# Altium project OwlRoundDelay.PrjPcb
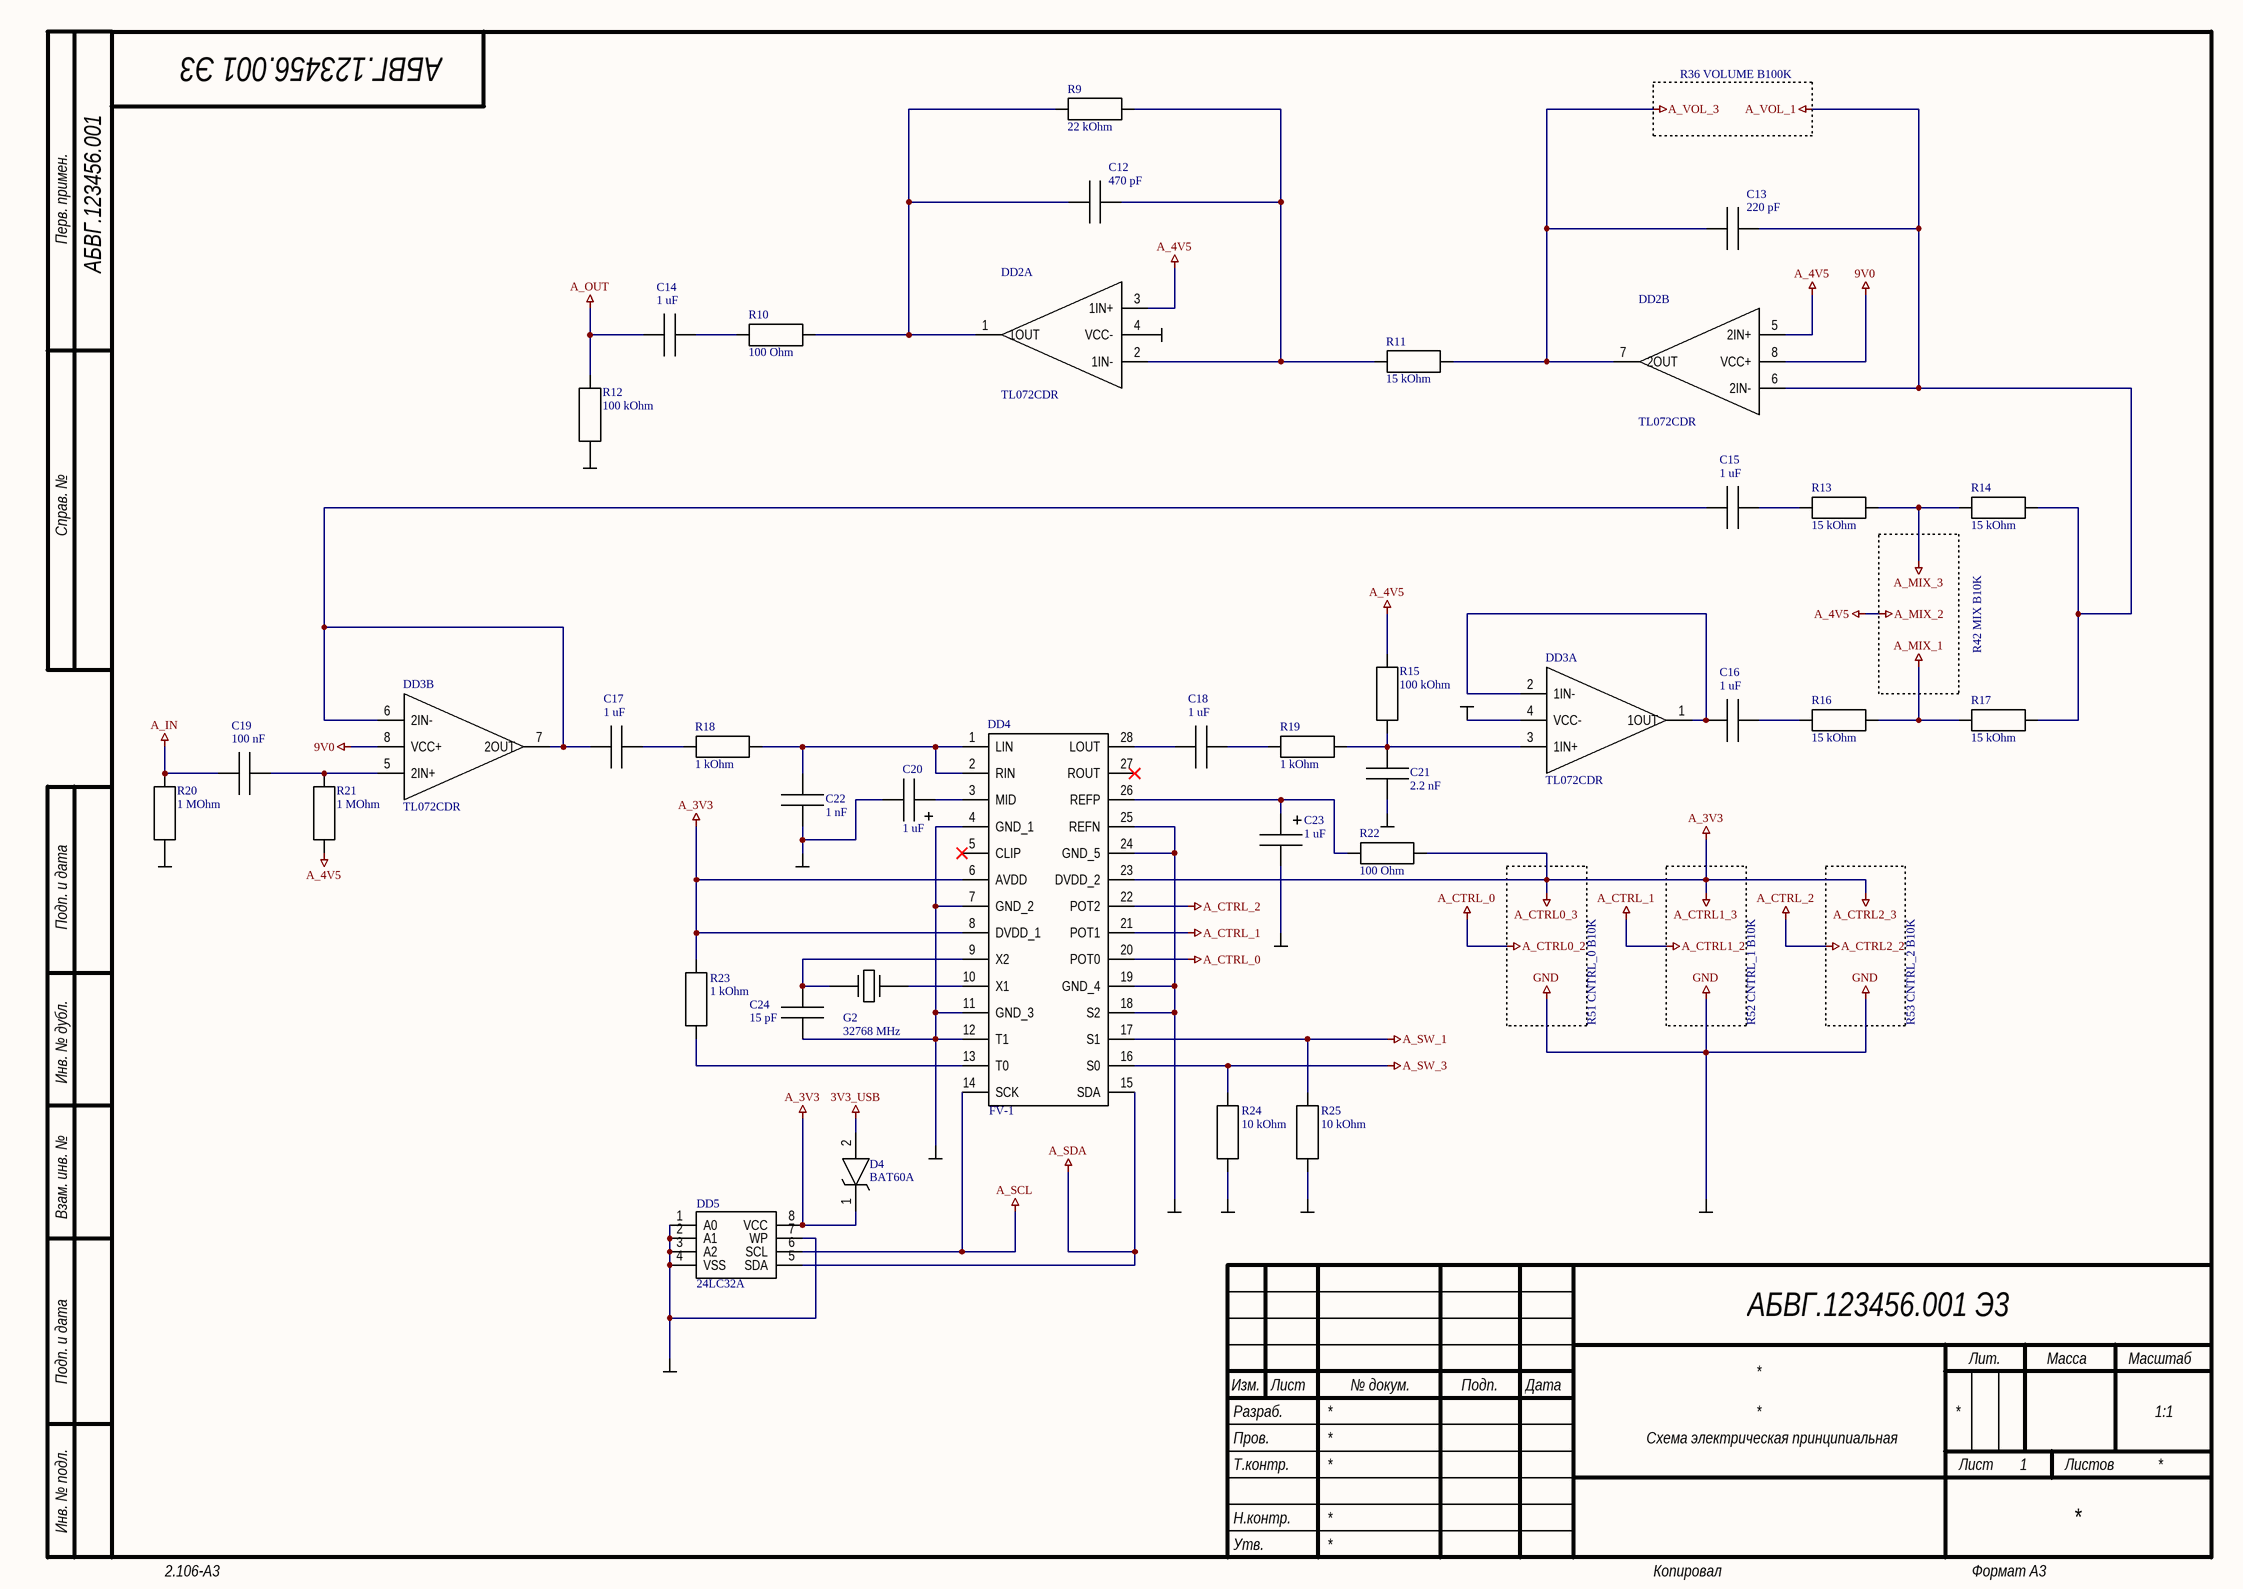
[diagram p0: ORD_FV1_1.SchDoc]
5 sheets, 107 parts. Net scope: global (net labels, ports and power ports of the same name join across sheets).
Board file: ORD_PCB.PcbDoc
Sheets:
  ORD_FV1_1.SchDoc
  ORD_FV1_2.SchDoc
  ORD_POWER.SchDoc
  ORD_CONNECTORS.SchDoc
  ORD_CH341A.SchDoc

## Sheet ORD_FV1_1.SchDoc
size 420 x 297 mm; Address1: Address1; Address2: Address2; Address3: Address3; Address4: Address4; DocumentNumber: АБВГ.123456.001 Э3; SheetNumber: 1; Scale: 1:1; DocumentType: Схема электрическая принципиальная; FirstReferrence: АБВГ.123456.001

### Parts
C12  470 pF  [C0805[2012]]
C13  220 pF  [C0805[2012]]
C14  1 uF  [C0805[2012]]
C15  1 uF  [C0805[2012]]
C16  1 uF  [C0805[2012]]
C17  1 uF  [C0805[2012]]
C18  1 uF  [C0805[2012]]
C19  100 nF  [C0805[2012]]
C20  1 uF  [C3216_CASE-A]
C21  2.2 nF  [C0805[2012]]
C22  1 nF  [C0805[2012]]
C23  1 uF  [C3216_CASE-A]
C24  15 pF  [C0805[2012]]
D4  BAT60A  [SOD323]
DD2  TL072CDR  [SO8]  (parts A,B of 2)
DD3  TL072CDR  [SO8]  (parts A,B of 2)
DD4  FV-1  [SOIC28]
DD5  24LC32A  [DIP8_WITH_SOCKET]
G2  32768 MHz  [HC-49]
R9  22 kOhm  [R0805[2012]]
R10  100 Ohm  [R0805[2012]]
R11  15 kOhm  [R0805[2012]]
R12  100 kOhm  [R0805[2012]]
R13  15 kOhm  [R0805[2012]]
R14  15 kOhm  [R0805[2012]]
R15  100 kOhm  [R0805[2012]]
R16  15 kOhm  [R0805[2012]]
R17  15 kOhm  [R0805[2012]]
R18  1 kOhm  [R0805[2012]]
R19  1 kOhm  [R0805[2012]]
R20  1 MOhm  [R0805[2012]]
R21  1 MOhm  [R0805[2012]]
R22  100 Ohm  [R0805[2012]]
R23  1 kOhm  [R0805[2012]]
R24  10 kOhm  [R0805[2012]]
R25  10 kOhm  [R0805[2012]]

### Nets
3V3_USB: D4.2(A)
9V0: DD2.8(VCC+) DD3.8(VCC+)
A_3V3: D4.1(K) DD4.6(AVDD) DD4.8(DVDD_1) DD4.23(DVDD_2) DD5.8(VCC) R22.1 R23.2  [also labelled A_CTRL0_3, A_CTRL1_3, A_CTRL2_3]
A_4V5: DD2.3(1IN+) DD2.5(2IN+) R15.1 R21.1  [also labelled A_MIX_2]
A_CTRL0_2: DD4.20(POT0)  [also labelled A_CTRL_0]
A_CTRL1_2: DD4.21(POT1)  [also labelled A_CTRL_1]
A_CTRL2_2: DD4.22(POT2)  [also labelled A_CTRL_2]
A_IN: C19.1 R20.2
A_MIX_1: R16.1 R17.2
A_MIX_3: R13.1 R14.2
A_OUT: C14.1 R12.2
A_SCL: DD4.14(SCK) DD5.6(SCL)
A_SDA: DD4.15(SDA) DD5.5(SDA)
A_SW_1: DD4.17(S1) R25.2
A_SW_3: DD4.16(S0) R24.2
A_VOL_1: C13.2 DD2.6(2IN-) R14.1 R17.1
A_VOL_3: C13.1 DD2.7(2OUT) R11.1
GND: C20.2 C21.1 C22.1 C23.2 C24.2 DD2.4(VCC-) DD3.4(VCC-) DD4.4(GND_1) DD4.7(GND_2) DD4.11(GND_3) DD4.12(T1) DD4.18(S2) DD4.19(GND_4) DD4.24(GND_5) DD4.25(REFN) DD5.1(A0) DD5.2(A1) DD5.3(A2) DD5.4(VSS) DD5.7(WP) R12.1 R20.1 R24.1 R25.1
NetC12_1: C12.1 DD2.1(1OUT) R9.2 R10.1
NetC12_2: C12.2 DD2.2(1IN-) R9.1 R11.2
NetC14_2: C14.2 R10.2
NetC15_1: C15.1 C17.1 DD3.6(2IN-) DD3.7(2OUT)
NetC15_2: C15.2 R13.2
NetC16_1: C16.1 DD3.1(1OUT) DD3.2(1IN-)
NetC16_2: C16.2 R16.2
NetC17_2: C17.2 R18.2
NetC18_1: C18.1 DD4.28(LOUT)
NetC18_2: C18.2 R19.2
NetC19_2: C19.2 DD3.5(2IN+) R21.2
NetC20_1: C20.1 DD4.3(MID)
NetC21_2: C21.2 DD3.3(1IN+) R15.2 R19.1
NetC22_2: C22.2 DD4.1(LIN) DD4.2(RIN) R18.1
NetC23_1: C23.1 DD4.26(REFP) R22.2
NetC24_1: C24.1 DD4.9(X2) G2.1
NetDD4_10: DD4.10(X1) G2.2
NetDD4_13: DD4.13(T0) R23.1

Not connected (* = marked no-connect by the designer): DD4 5(CLIP)* 27(ROUT)*

### Notes on the sheet
- R36 VOLUME B100K
- R42 MIX B10K
- R51 CNTRL_0 B10K
- R52 CNTRL_1 B10K
- R53 CNTRL_2 B10K
- Перв. примен.
- Справ. №
- Подп. и дата
- Инв. № дубл.
- Взам. инв. №
- Разраб.
- Изм.
- Лист
- № докум.
- Подп.
- Дата
- Лит.
- Масса
- Масштаб
- Пров.
- Т.контр.
- Листов
- Инв. № подл.
- Утв.
- Н.контр.
- 2.106-A3
- Копировал
- Формат А3

### Library data of the parts
C12-C19 C21 C22 C24 = Capacitor: Manufacture: *; ManufacturerPartNumber: *; Power/Voltage: *; Quantity: *; Rem: *; TKE: *; Tolerance: *; Корпус: *; Примечание: *
  C12: Value: 470 pF
  C13: Value: 220 pF
  C14-C18: Value: 1 uF
  C19: Value: 100 nF
  C21: Value: 2.2 nF
  C22: Value: 1 nF
  C24: Value: 15 pF
C20 C23 = Capacitor_Pol: Manufacture: *; ManufacturerPartNumber: *; Power/Voltage: *; Quantity: *; Rem: *; TKE: *; Tolerance: *; Value: 1 uF; Корпус: *; Примечание: *
D4 = BAT60A: Diode Schottky 10V 3A Automotive 2-Pin SOD-323 T/R; Manufacturer_Part_Number: BAT60A; Arrow Part Number: BAT60A
DD2 DD3 = TL072CDR: TL072CDR, Dual Operational Amplifier 4 MHz -18 to 18V, 8-Pin SO; Manufacturer_Name: STMicroelectronics; Manufacturer_Part_Number: LM358DT; Allied_Number: 70013708; Geometry.Height: 1.75mm; Mouser Part Number: 511-LM358DT; Mouser Price/Stock: https://www.mouser.com/Search/Refine.aspx?Keyword=511-LM358DT; RS Part Number: 7140827P; RS Price/Stock: http://uk.rs-online.com/web/p/products/7140827P; Allied Price/Stock: http://www.alliedelec.com/stmicroelectronics-lm358dt/70013708/; Datasheet Link: http://www.st.com/st-web-ui/static/active/en/resource/technical/document/datasheet/CD00000464.pdf
DD4 = FV-1: FV-1 Reverb IC, Integrated Stereo ADC & DAC, Integrated Circuit, SOIC-28 300 MIL; Manufacturer_Name: Spin Semiconductor; Geometry.Height: 2.51mm; Manufacturer_Part_Number: FV-1 Reverb IC; Mouser Part Number: *; Mouser Price/Stock: *; RS Part Number: *; RS Price/Stock: *; Datasheet Link: http://www.spinsemi.com/Products/datasheets/spn1001/FV-1.pdf
DD5 = 24LC32A: 32K I2C Serial EEPROM with Quarter-Array Write-Protect; Manufacturer_Name: Microchip; Manufacturer_Part_Number: 24LC32AF-I/P; Allied_Number: 70570177; Mouser Part Number: 579-24LC32AF-I/P; Mouser Price/Stock: https://www.mouser.com/Search/Refine.aspx?Keyword=579-24LC32AF-I%2FP; RS Part Number: *; RS Price/Stock: *; Allied Price/Stock: https://www.alliedelec.com/microchip-technology-inc-24lc32af-i-p/70570177/; Datasheet Link: *
G2 = Crystal_2pin: Value: *
R9-R25 = Resistor: Manufacture: *; ManufacturerPartNumber: *; Power/Voltage: *; Quantity: *; Rem: *; TKE: *; Tolerance: *; Корпус: *; Примечание: *
  R9: Value: 22 kOhm
  R10 R22: Value: 100 Ohm
  R11 R13 R14 R16 R17: Value: 15 kOhm
  R12 R15: Value: 100 kOhm
  R18 R19 R23: Value: 1 kOhm
  R20 R21: Value: 1 MOhm
  R24 R25: Value: 10 kOhm

## Sheet ORD_FV1_2.SchDoc
size 420 x 297 mm; Address1: Address1; Address2: Address2; Address3: Address3; Address4: Address4; DocumentNumber: АБВГ.123456.001 Э3; SheetNumber: 1; Scale: 1:1; DocumentType: Схема электрическая принципиальная; FirstReferrence: АБВГ.123456.001
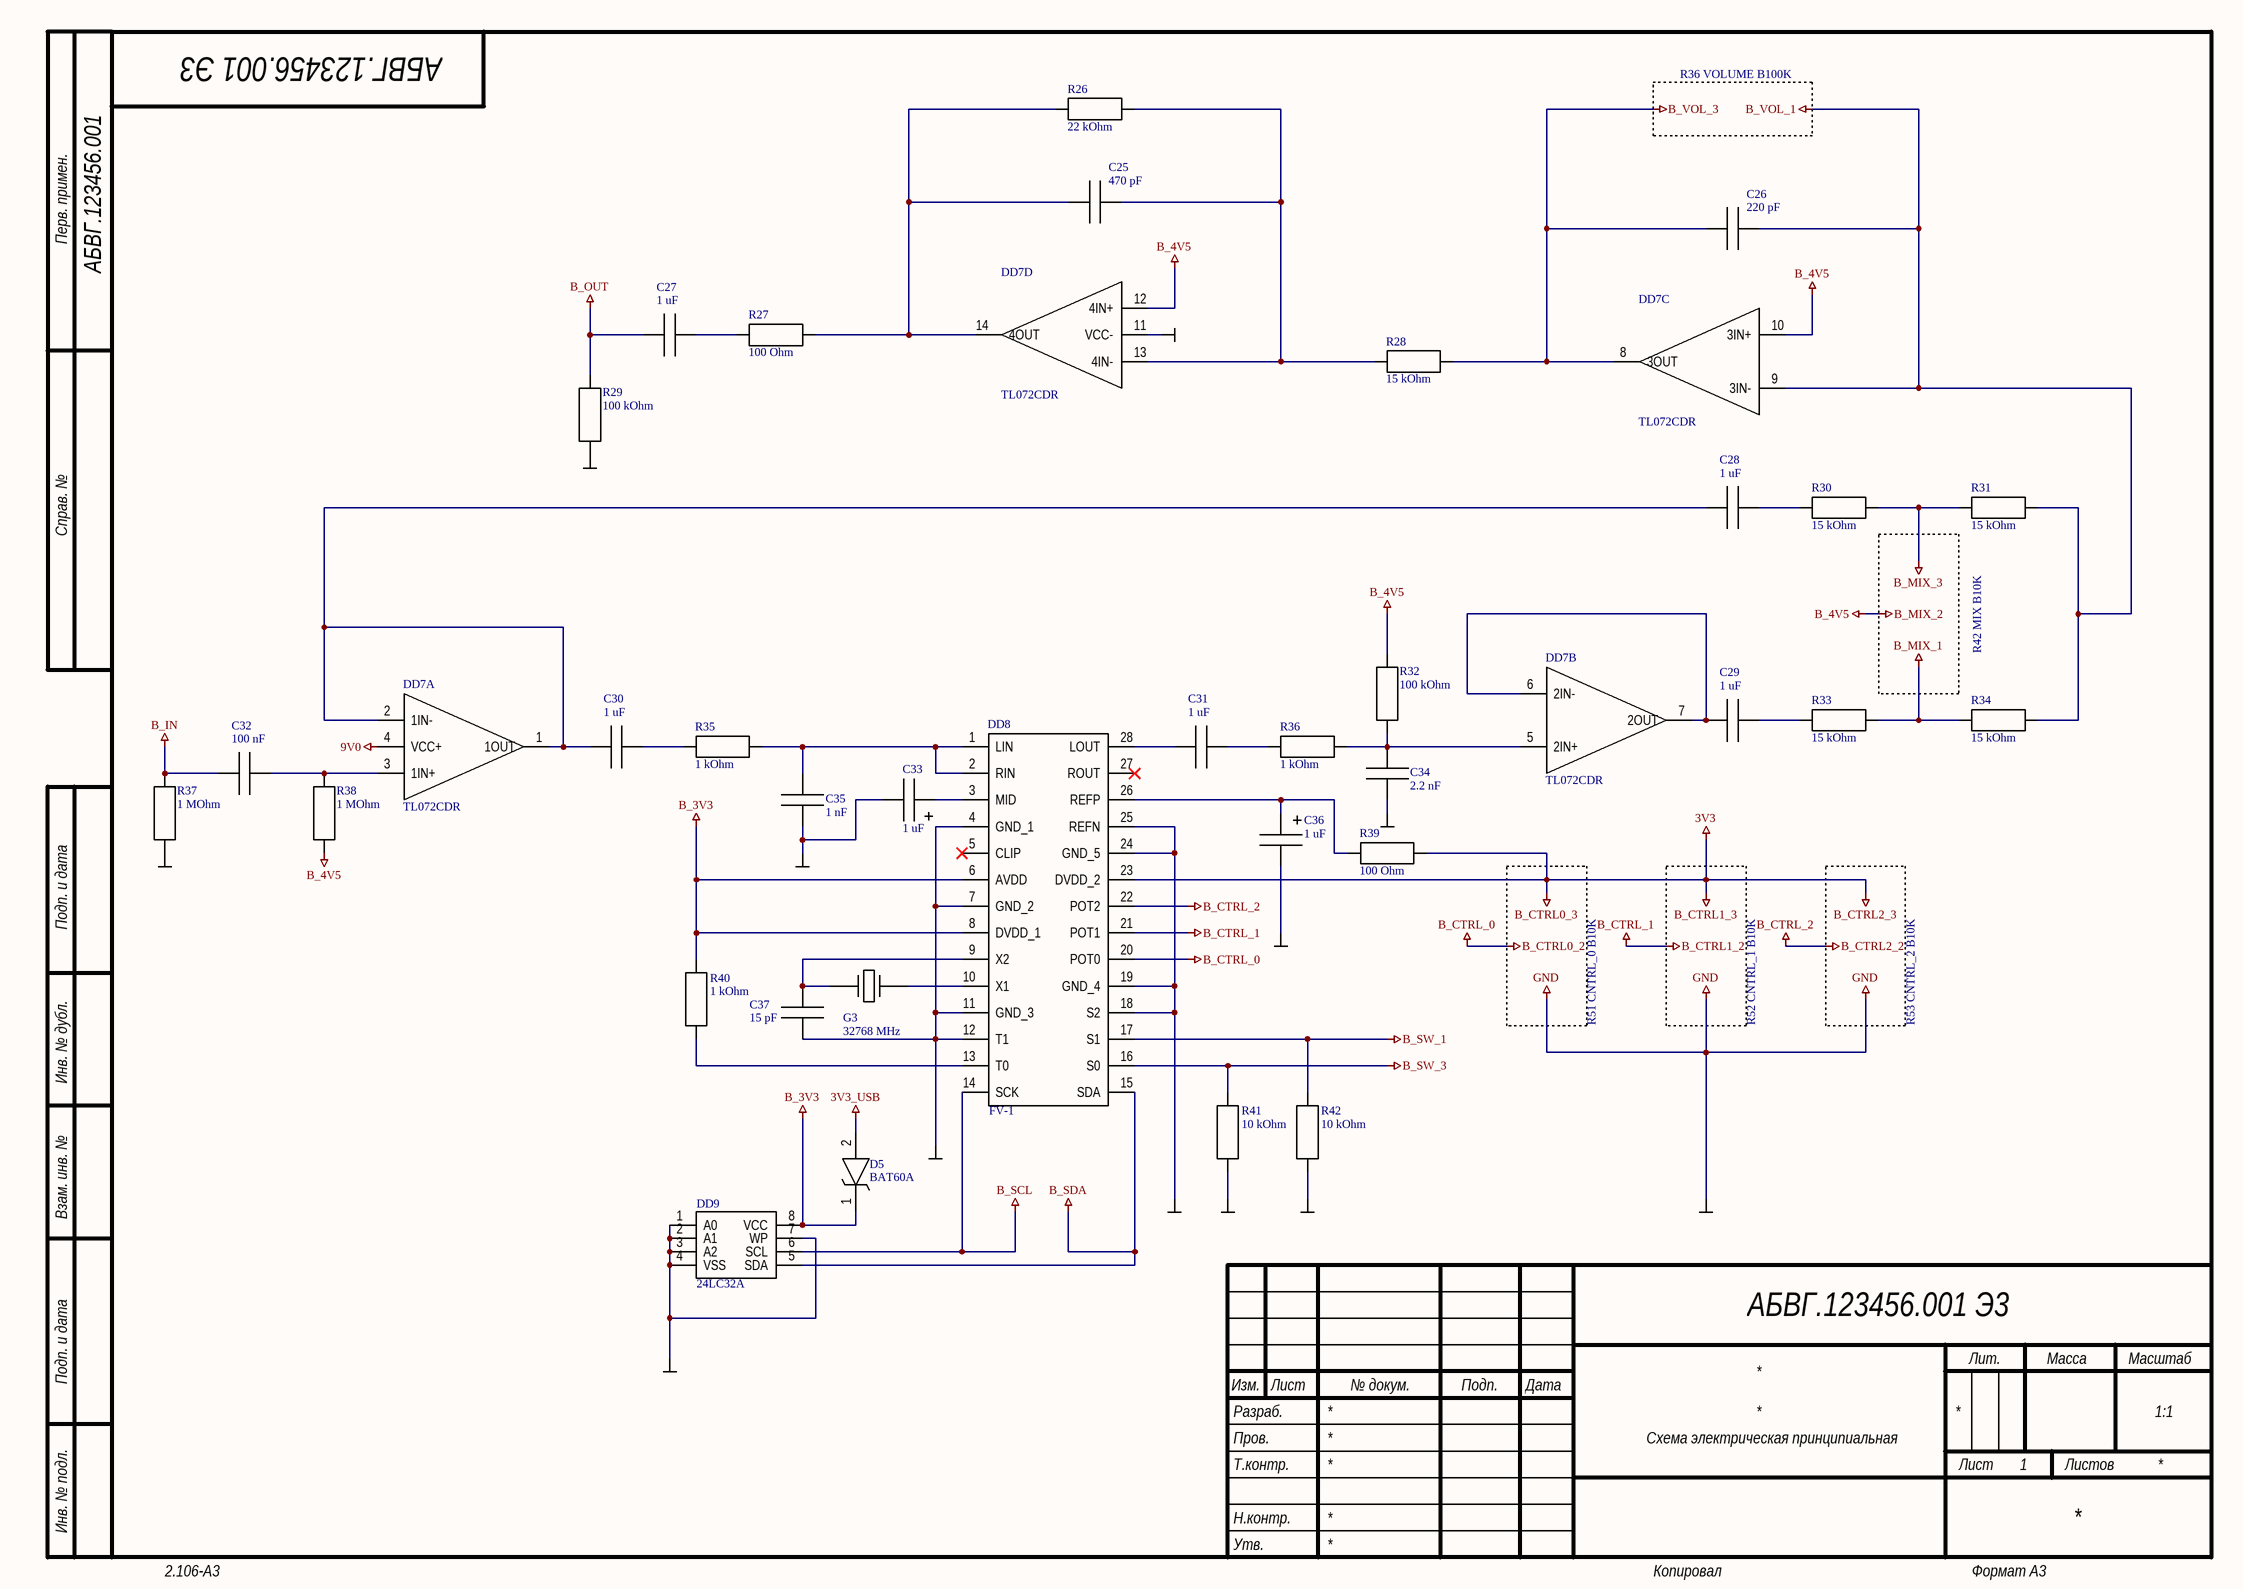
[diagram p1: ORD_FV1_2.SchDoc]

### Parts
C25  470 pF  [C0805[2012]]
C26  220 pF  [C0805[2012]]
C27  1 uF  [C0805[2012]]
C28  1 uF  [C0805[2012]]
C29  1 uF  [C0805[2012]]
C30  1 uF  [C0805[2012]]
C31  1 uF  [C0805[2012]]
C32  100 nF  [C0805[2012]]
C33  1 uF  [C3216_CASE-A]
C34  2.2 nF  [C0805[2012]]
C35  1 nF  [C0805[2012]]
C36  1 uF  [C3216_CASE-A]
C37  15 pF  [C0805[2012]]
D5  BAT60A  [SOD323]
DD7  TL072CDR  [SO14]  (parts A,B,C,D of 4)
DD8  FV-1  [SOIC28]
DD9  24LC32A  [DIP8_WITH_SOCKET]
G3  32768 MHz  [HC-49]
R26  22 kOhm  [R0805[2012]]
R27  100 Ohm  [R0805[2012]]
R28  15 kOhm  [R0805[2012]]
R29  100 kOhm  [R0805[2012]]
R30  15 kOhm  [R0805[2012]]
R31  15 kOhm  [R0805[2012]]
R32  100 kOhm  [R0805[2012]]
R33  15 kOhm  [R0805[2012]]
R34  15 kOhm  [R0805[2012]]
R35  1 kOhm  [R0805[2012]]
R36  1 kOhm  [R0805[2012]]
R37  1 MOhm  [R0805[2012]]
R38  1 MOhm  [R0805[2012]]
R39  100 Ohm  [R0805[2012]]
R40  1 kOhm  [R0805[2012]]
R41  10 kOhm  [R0805[2012]]
R42  10 kOhm  [R0805[2012]]

### Nets
3V3: DD8.23(DVDD_2) R39.1  [also labelled B_CTRL0_3, B_CTRL1_3, B_CTRL2_3]
3V3_USB: D5.2(A)
9V0: DD7.4(VCC+)
B_3V3: D5.1(K) DD8.6(AVDD) DD8.8(DVDD_1) DD9.8(VCC) R40.2
B_4V5: DD7.10(3IN+) DD7.12(4IN+) R32.1 R38.1  [also labelled B_MIX_2]
B_CTRL0_2: DD8.20(POT0)  [also labelled B_CTRL_0]
B_CTRL1_2: DD8.21(POT1)  [also labelled B_CTRL_1]
B_CTRL2_2: DD8.22(POT2)  [also labelled B_CTRL_2]
B_IN: C32.1 R37.2
B_MIX_1: R33.1 R34.2
B_MIX_3: R30.1 R31.2
B_OUT: C27.1 R29.2
B_SCL: DD8.14(SCK) DD9.6(SCL)
B_SDA: DD8.15(SDA) DD9.5(SDA)
B_SW_1: DD8.17(S1) R42.2
B_SW_3: DD8.16(S0) R41.2
B_VOL_1: C26.2 DD7.9(3IN-) R31.1 R34.1
B_VOL_3: C26.1 DD7.8(3OUT) R28.1
GND: C33.2 C34.1 C35.1 C36.2 C37.2 DD7.11(VCC-) DD8.4(GND_1) DD8.7(GND_2) DD8.11(GND_3) DD8.12(T1) DD8.18(S2) DD8.19(GND_4) DD8.24(GND_5) DD8.25(REFN) DD9.1(A0) DD9.2(A1) DD9.3(A2) DD9.4(VSS) DD9.7(WP) R29.1 R37.1 R41.1 R42.1
NetC25_1: C25.1 DD7.14(4OUT) R26.2 R27.1
NetC25_2: C25.2 DD7.13(4IN-) R26.1 R28.2
NetC27_2: C27.2 R27.2
NetC28_1: C28.1 C30.1 DD7.1(1OUT) DD7.2(1IN-)
NetC28_2: C28.2 R30.2
NetC29_1: C29.1 DD7.6(2IN-) DD7.7(2OUT)
NetC29_2: C29.2 R33.2
NetC30_2: C30.2 R35.2
NetC31_1: C31.1 DD8.28(LOUT)
NetC31_2: C31.2 R36.2
NetC32_2: C32.2 DD7.3(1IN+) R38.2
NetC33_1: C33.1 DD8.3(MID)
NetC34_2: C34.2 DD7.5(2IN+) R32.2 R36.1
NetC35_2: C35.2 DD8.1(LIN) DD8.2(RIN) R35.1
NetC36_1: C36.1 DD8.26(REFP) R39.2
NetC37_1: C37.1 DD8.9(X2) G3.1
NetDD8_10: DD8.10(X1) G3.2
NetDD8_13: DD8.13(T0) R40.1

Not connected (* = marked no-connect by the designer): DD8 5(CLIP)* 27(ROUT)*

### Notes on the sheet
- R36 VOLUME B100K
- R42 MIX B10K
- R51 CNTRL_0 B10K
- R52 CNTRL_1 B10K
- R53 CNTRL_2 B10K
- Перв. примен.
- Справ. №
- Подп. и дата
- Инв. № дубл.
- Взам. инв. №
- Разраб.
- Изм.
- Лист
- № докум.
- Подп.
- Дата
- Лит.
- Масса
- Масштаб
- Пров.
- Т.контр.
- Листов
- Инв. № подл.
- Утв.
- Н.контр.
- 2.106-A3
- Копировал
- Формат А3

### Library data of the parts
C25-C32 C34 C35 C37 = Capacitor: Manufacture: *; ManufacturerPartNumber: *; Power/Voltage: *; Quantity: *; Rem: *; TKE: *; Tolerance: *; Корпус: *; Примечание: *
  C25: Value: 470 pF
  C26: Value: 220 pF
  C27-C31: Value: 1 uF
  C32: Value: 100 nF
  C34: Value: 2.2 nF
  C35: Value: 1 nF
  C37: Value: 15 pF
C33 C36 = Capacitor_Pol: Manufacture: *; ManufacturerPartNumber: *; Power/Voltage: *; Quantity: *; Rem: *; TKE: *; Tolerance: *; Value: 1 uF; Корпус: *; Примечание: *
D5 = BAT60A: as D4 on sheet ORD_FV1_1; Manufacturer_Part_Number: BAT60A; Arrow Part Number: BAT60A
DD7 = TL074CDT: TL072CDR, Dual Operational Amplifier 4 MHz -18 to 18V, 8-Pin SO; Manufacturer_Name: STMicroelectronics; Manufacturer_Part_Number: LM358DT; Allied_Number: 70013708; Geometry.Height: 1.75mm; Mouser Part Number: 511-LM358DT; Mouser Price/Stock: https://www.mouser.com/Search/Refine.aspx?Keyword=511-LM358DT; RS Part Number: 7140827P; RS Price/Stock: http://uk.rs-online.com/web/p/products/7140827P; Allied Price/Stock: http://www.alliedelec.com/stmicroelectronics-lm358dt/70013708/; Datasheet Link: http://www.st.com/st-web-ui/static/active/en/resource/technical/document/datasheet/CD00000464.pdf
DD8 = FV-1: as DD4 on sheet ORD_FV1_1; Manufacturer_Part_Number: FV-1 Reverb IC; Mouser Part Number: *; Mouser Price/Stock: *; RS Part Number: *; RS Price/Stock: *; Datasheet Link: http://www.spinsemi.com/Products/datasheets/spn1001/FV-1.pdf
DD9 = 24LC32A: as DD5 on sheet ORD_FV1_1; Mouser Part Number: 579-24LC32AF-I/P; Mouser Price/Stock: https://www.mouser.com/Search/Refine.aspx?Keyword=579-24LC32AF-I%2FP; RS Part Number: *; RS Price/Stock: *; Allied Price/Stock: https://www.alliedelec.com/microchip-technology-inc-24lc32af-i-p/70570177/; Datasheet Link: *
G3 = Crystal_2pin: Value: *
R26-R42 = Resistor: Manufacture: *; ManufacturerPartNumber: *; Power/Voltage: *; Quantity: *; Rem: *; TKE: *; Tolerance: *; Корпус: *; Примечание: *
  R26: Value: 22 kOhm
  R27 R39: Value: 100 Ohm
  R28 R30 R31 R33 R34: Value: 15 kOhm
  R29 R32: Value: 100 kOhm
  R35 R36 R40: Value: 1 kOhm
  R37 R38: Value: 1 MOhm
  R41 R42: Value: 10 kOhm

## Sheet ORD_POWER.SchDoc
size 420 x 297 mm; Address1: Address1; Address2: Address2; Address3: Address3; Address4: Address4; DocumentNumber: АБВГ.123456.001 Э3; SheetNumber: 1; Scale: 1:1; DocumentType: Схема электрическая принципиальная; FirstReferrence: АБВГ.123456.001
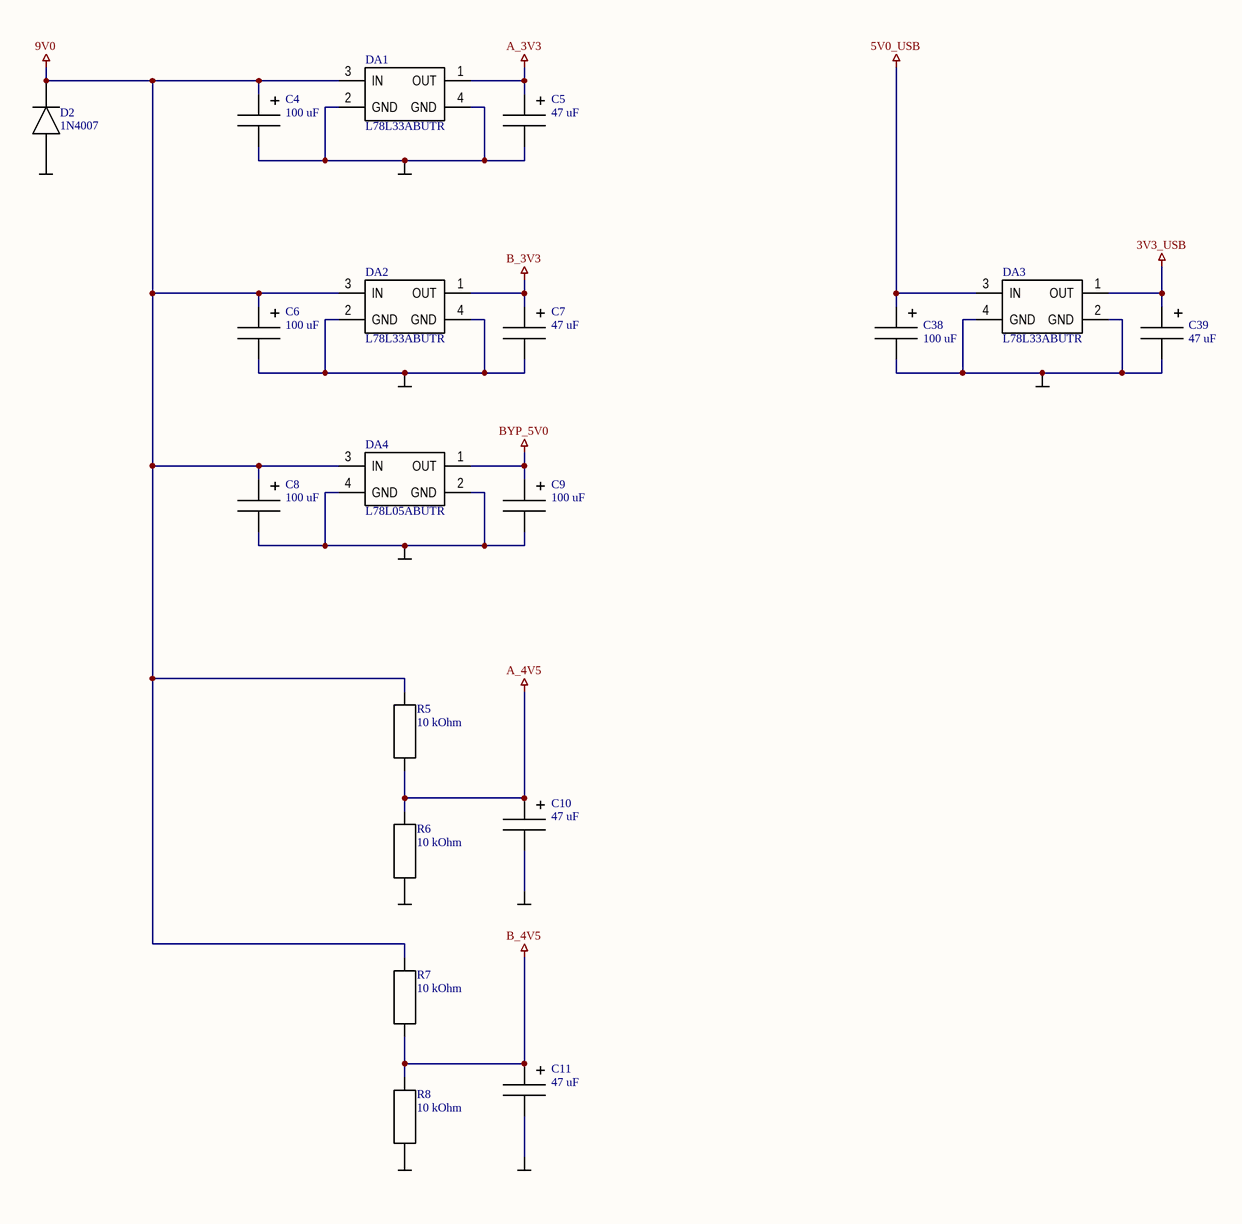
[diagram p2: ORD_POWER.SchDoc]

### Parts
C4  100 uF  [C7343_CASE-D]
C5  47 uF  [C3528_CASE-B]
C6  100 uF  [C7343_CASE-D]
C7  47 uF  [C3528_CASE-B]
C8  100 uF  [C7343_CASE-D]
C9  100 uF  [C3528_CASE-B]
C10  47 uF  [C3528_CASE-B]
C11  47 uF  [C3528_CASE-B]
C38  100 uF  [C7343_CASE-D]
C39  47 uF  [C3528_CASE-B]
D2  1N4007  [DO-41]
DA1  L78L33ABUTR  [SOT-89]
DA2  L78L33ABUTR  [SOT-89]
DA3  L78L33ABUTR  [SOT-89]
DA4  L78L05ABUTR  [SOT-89]
R5  10 kOhm  [R0805[2012]]
R6  10 kOhm  [R0805[2012]]
R7  10 kOhm  [R0805[2012]]
R8  10 kOhm  [R0805[2012]]

### Nets
3V3_USB: C39.1 DA3.1(OUT)
5V0_USB: C38.1 DA3.3(IN)
9V0: C4.1 C6.1 C8.1 D2.1(K) DA1.3(IN) DA2.3(IN) DA4.3(IN) R5.2 R7.2
A_3V3: C5.1 DA1.1(OUT)
A_4V5: C10.1 R5.1 R6.2
B_3V3: C7.1 DA2.1(OUT)
B_4V5: C11.1 R7.1 R8.2
BYP_5V0: C9.1 DA4.1(OUT)
GND: C4.2 C5.2 C6.2 C7.2 C8.2 C9.2 C10.2 C11.2 C38.2 C39.2 D2.2(A) DA1.2(GND) DA1.4(GND) DA2.2(GND) DA2.4(GND) DA3.2(GND) DA3.4(GND) DA4.2(GND) DA4.4(GND) R6.1 R8.1

### Notes on the sheet
- Перв. примен.
- Справ. №
- Подп. и дата
- Инв. № дубл.
- Взам. инв. №
- Разраб.
- Изм.
- Лист
- № докум.
- Подп.
- Дата
- Лит.
- Масса
- Масштаб
- Пров.
- Т.контр.
- Листов
- Инв. № подл.
- Утв.
- Н.контр.
- 2.106-A3
- Копировал
- Формат А3

### Library data of the parts
C4-C11 C38 C39 = Capacitor_Pol: Manufacture: *; ManufacturerPartNumber: *; Power/Voltage: *; Quantity: *; Rem: *; TKE: *; Tolerance: *; Корпус: *; Примечание: *
  C4 C6 C8 C9 C38: Value: 100 uF
  C5 C7 C10 C11 C39: Value: 47 uF
D2 = 1N4007: Geometry.Height: 1.35mm; Manufacturer_Name: 1N4007; Manufacturer_Part_Number: 1N4007
DA1-DA3 = L78L33ABUTR: Standard Regulator Pos 3.3V 0.1A L78L33ABUTR, Single Linear Voltage Regulator, 100mA 3.3 V, 3-Pin SOT-89; Manufacturer_Name: New Japan Radio; Manufacturer_Part_Number: NJM78L05UA-TE1; Allied_Number: R1030699; Mouser Part Number: *; Mouser Price/Stock: *; RS Part Number: 7139502P; RS Price/Stock: http://uk.rs-online.com/web/p/products/7139502P; Allied Price/Stock: https://www.alliedelec.com/new-japan-radio-njm78l05ua-te1/R1030699/; Datasheet Link: http://uk.rs-online.com/web/p/products/7139502
DA4 = L78L05ABUTR: Standard Regulator Pos 5V 0.1A L78L05ABUTR, Single Linear Voltage Regulator, 100mA 5 V, 3-Pin SOT-89; Manufacturer_Name: New Japan Radio; Manufacturer_Part_Number: NJM78L05UA-TE1; Allied_Number: R1030699; Mouser Part Number: *; Mouser Price/Stock: *; RS Part Number: 7139502P; RS Price/Stock: http://uk.rs-online.com/web/p/products/7139502P; Allied Price/Stock: https://www.alliedelec.com/new-japan-radio-njm78l05ua-te1/R1030699/; Datasheet Link: http://uk.rs-online.com/web/p/products/7139502
R5-R8 = Resistor: Manufacture: *; ManufacturerPartNumber: *; Power/Voltage: *; Quantity: *; Rem: *; TKE: *; Tolerance: *; Корпус: *; Примечание: *; Value: 10 kOhm

## Sheet ORD_CONNECTORS.SchDoc
size 420 x 297 mm; Address1: Address1; Address2: Address2; Address3: Address3; Address4: Address4; DocumentNumber: АБВГ.123456.001 Э3; SheetNumber: 1; Scale: 1:1; DocumentType: Схема электрическая принципиальная; FirstReferrence: АБВГ.123456.001
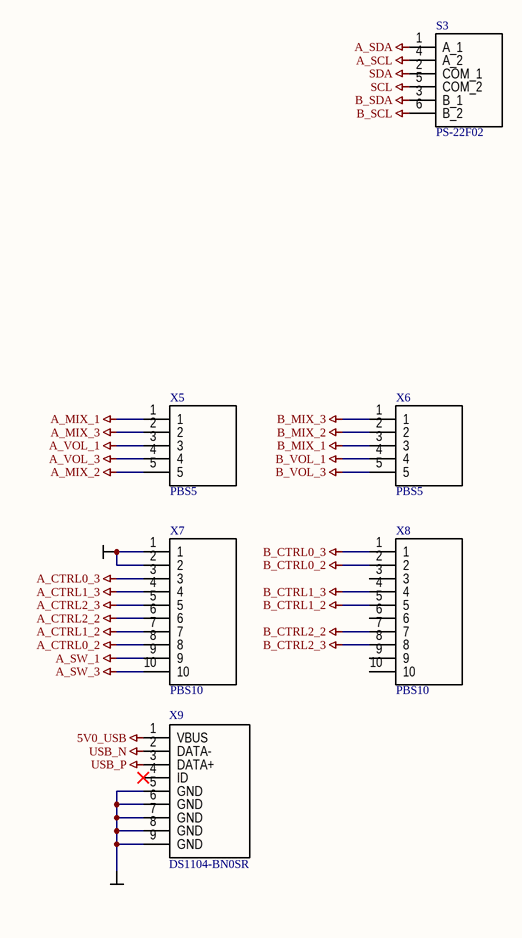
[diagram p3: ORD_CONNECTORS.SchDoc]

### Parts
S3  PS-22F02  [PS-22F02]
X5  PBS5  [pbs-5]
X6  PBS5  [pbs-5]
X7  PBS10  [PBS-10]
X8  PBS10  [PBS-10]
X9  DS1104-BN0SR  [DS1104-BN0SR]

### Nets
5V0_USB: X9.1(VBUS)
A_CTRL0_2: X7.8
A_CTRL0_3: X7.3 X7.4 X7.5  [also labelled A_CTRL1_3, A_CTRL2_3]  [project net A_3V3]
A_CTRL1_2: X7.7
A_CTRL2_2: X7.6
A_MIX_1: X5.1
A_MIX_2: X5.5  [project net A_4V5]
A_MIX_3: X5.2
A_SCL: S3.4(A_2)
A_SDA: S3.1(A_1)
A_SW_1: X7.9
A_SW_3: X7.10
A_VOL_1: X5.3
A_VOL_3: X5.4
B_CTRL0_2: X8.2
B_CTRL0_3: X8.1 X8.4 X8.8  [also labelled B_CTRL1_3, B_CTRL2_3]  [project net 3V3]
B_CTRL1_2: X8.5
B_CTRL2_2: X8.7
B_MIX_1: X6.3
B_MIX_2: X6.2  [project net B_4V5]
B_MIX_3: X6.1
B_SCL: S3.6(B_2)
B_SDA: S3.3(B_1)
B_VOL_1: X6.4
B_VOL_3: X6.5
GND: X7.1 X7.2 X9.5(GND) X9.6(GND) X9.7(GND) X9.8(GND) X9.9(GND)
SCL: S3.5(COM_2)
SDA: S3.2(COM_1)
USB_N: X9.2(DATA-)
USB_P: X9.3(DATA+)

Not connected (* = marked no-connect by the designer): X8 3 6 9 10; X9 4(ID)*

### Notes on the sheet
- Перв. примен.
- Справ. №
- Подп. и дата
- Инв. № дубл.
- Взам. инв. №
- Разраб.
- Изм.
- Лист
- № докум.
- Подп.
- Дата
- Лит.
- Масса
- Масштаб
- Пров.
- Т.контр.
- Листов
- Инв. № подл.
- Утв.
- Н.контр.
- 2.106-A3
- Копировал
- Формат А3

### Library data of the parts
S3 = PS-22F02: Switch 6-pin; Manufacturer_Name: Switronic; Manufacturer_Part_Number: IS-2235; Geometry.Height: 5mm; Mouser Part Number: *; Mouser Price/Stock: *; RS Part Number: *; RS Price/Stock: *; Datasheet Link: http://www.switronic.com/gallery/detail/400
X5 X6 = PBS5: 2.54 mm; System: Connector
X7 X8 = PBS10: 2.54 mm; System: Connector
X9 = DS1104-BN0SR: MINI USB Connector; Manufacturer_Name: Connfly; Geometry.Height: 3.95mm; Manufacturer_Part_Number: DS1104-BN0SR; Mouser Part Number: *; Mouser Price/Stock: *; RS Part Number: *; RS Price/Stock: *; Datasheet Link: https://www.tme.eu/en/Document/609ffd1fdbc4bea9351dc791fd9a9696/musb-g5p.pdf

## Sheet ORD_CH341A.SchDoc
size 420 x 297 mm; Address1: Address1; Address2: Address2; Address3: Address3; Address4: Address4; DocumentNumber: АБВГ.123456.001 Э3; SheetNumber: 1; Scale: 1:1; DocumentType: Схема электрическая принципиальная; FirstReferrence: АБВГ.123456.001
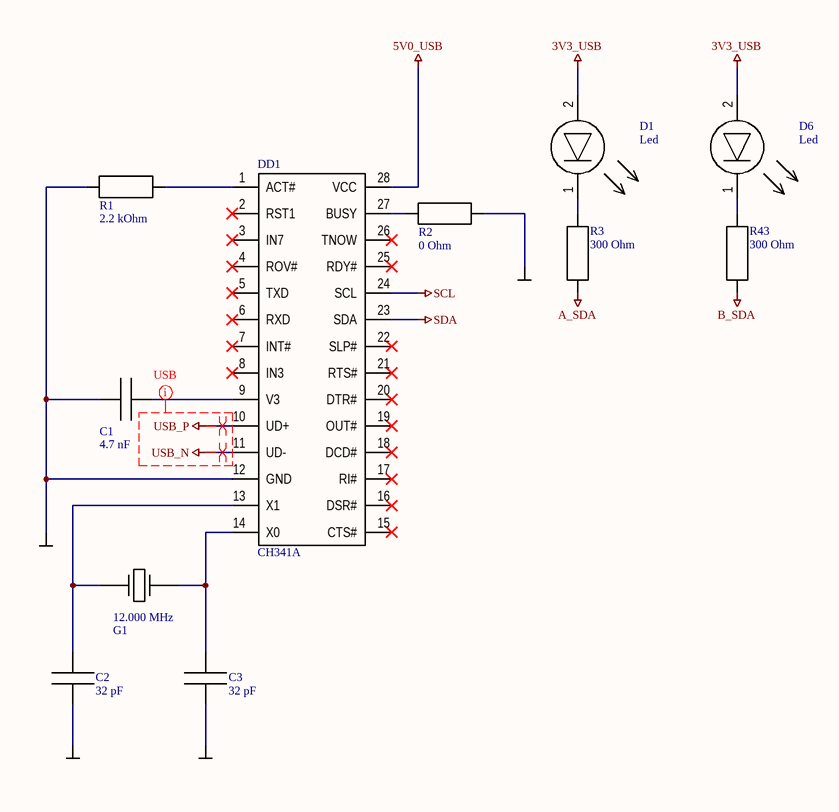
[diagram p4: ORD_CH341A.SchDoc]

### Parts
C1  4.7 nF  [C0603[1608]]
C2  32 pF  [C0603[1608]]
C3  32 pF  [C0603[1608]]
D1  Led  [LED_Blue_3mm_angled]
D6  Led  [LED_Red_3mm_angled]
DD1  CH341A  [SOIC28]
G1  12.000 MHz  [HC-49]
R1  2.2 kOhm  [R0603[1608]]
R2  0 Ohm  [R0603[1608]]
R3  300 Ohm  [R0603[1608]]
R43  300 Ohm  [R0603[1608]]

### Nets
3V3_USB: D1.2 D6.2
5V0_USB: DD1.28(VCC)
A_SDA: R3.1
B_SDA: R43.1
GND: C1.1 C2.1 C3.1 DD1.12(GND) R1.1 R2.2
SCL: DD1.24(SCL)
SDA: DD1.23(SDA)
USB_N: DD1.11(UD-)
USB_P: DD1.10(UD+)
NetC1_2: C1.2 DD1.9(V3)
NetC2_2: C2.2 DD1.13(X1) G1.1
NetC3_2: C3.2 DD1.14(X0) G1.2
NetD1_1: D1.1 R3.2
NetD6_1: D6.1 R43.2
NetDD1_1: DD1.1(ACT#) R1.2
NetDD1_27: DD1.27(BUSY) R2.1

Not connected (* = marked no-connect by the designer): DD1 2(RST1)* 3(IN7)* 4(ROV#)* 5(TXD)* 6(RXD)* 7(INT#)* 8(IN3)* 15(CTS#)* 16(DSR#)* 17(RI#)* 18(DCD#)* 19(OUT#)* 20(DTR#)* 21(RTS#)* 22(SLP#)* 25(RDY#)* 26(TNOW)*

### Layout directives
differential pair: USB_N, USB_P
net class USB: USB_N, USB_P

### Notes on the sheet
- Перв. примен.
- Справ. №
- Подп. и дата
- Инв. № дубл.
- Взам. инв. №
- Разраб.
- Изм.
- Лист
- № докум.
- Подп.
- Дата
- Лит.
- Масса
- Масштаб
- Пров.
- Т.контр.
- Листов
- Инв. № подл.
- Утв.
- Н.контр.
- 2.106-A3
- Копировал
- Формат А3

### Library data of the parts
C1-C3 = Capacitor: Manufacture: *; ManufacturerPartNumber: *; Power/Voltage: *; Quantity: *; Rem: *; TKE: *; Tolerance: *; Корпус: *; Примечание: *
  C1: Value: 4.7 nF
  C2 C3: Value: 32 pF
DD1 = CH341A: USB Bus Convert Chip CH341A; Manufacturer_Name: Spin Semiconductor; Manufacturer_Part_Number: FV-1 Reverb IC; Geometry.Height: 2.51mm; Mouser Part Number: *; Mouser Price/Stock: *; RS Part Number: *; RS Price/Stock: *; Datasheet Link: http://www.spinsemi.com/Products/datasheets/spn1001/FV-1.pdf
G1 = Crystal_2pin: Value: *
R1-R3 R43 = Resistor: Manufacture: *; ManufacturerPartNumber: *; Power/Voltage: *; Quantity: *; Rem: *; TKE: *; Tolerance: *; Корпус: *; Примечание: *
  R1: Value: 2.2 kOhm
  R2: Value: 0 Ohm
  R3 R43: Value: 300 Ohm
D1 D6 = Led: ManufacturerPartNumber: *

## Nets that join several sheets
3V3: ORD_FV1_2 (DD8.23 R39.1), ORD_CONNECTORS (X8.1 X8.4 X8.8)
3V3_USB: ORD_FV1_1 (D4.2), ORD_FV1_2 (D5.2), ORD_POWER (C39.1 DA3.1), ORD_CH341A (D1.2 D6.2)
5V0_USB: ORD_POWER (C38.1 DA3.3), ORD_CONNECTORS (X9.1), ORD_CH341A (DD1.28)
9V0: ORD_FV1_1 (DD2.8 DD3.8), ORD_FV1_2 (DD7.4), ORD_POWER (9 pins)
A_3V3: ORD_FV1_1 (7 pins), ORD_POWER (C5.1 DA1.1), ORD_CONNECTORS (X7.3 X7.4 X7.5)
A_4V5: ORD_FV1_1 (DD2.3 DD2.5 R15.1 R21.1), ORD_POWER (C10.1 R5.1 R6.2), ORD_CONNECTORS (X5.5)
A_CTRL0_2: ORD_FV1_1 (DD4.20), ORD_CONNECTORS (X7.8)
A_CTRL1_2: ORD_FV1_1 (DD4.21), ORD_CONNECTORS (X7.7)
A_CTRL2_2: ORD_FV1_1 (DD4.22), ORD_CONNECTORS (X7.6)
A_MIX_1: ORD_FV1_1 (R16.1 R17.2), ORD_CONNECTORS (X5.1)
A_MIX_3: ORD_FV1_1 (R13.1 R14.2), ORD_CONNECTORS (X5.2)
A_SCL: ORD_FV1_1 (DD4.14 DD5.6), ORD_CONNECTORS (S3.4)
A_SDA: ORD_FV1_1 (DD4.15 DD5.5), ORD_CONNECTORS (S3.1), ORD_CH341A (R3.1)
A_SW_1: ORD_FV1_1 (DD4.17 R25.2), ORD_CONNECTORS (X7.9)
A_SW_3: ORD_FV1_1 (DD4.16 R24.2), ORD_CONNECTORS (X7.10)
A_VOL_1: ORD_FV1_1 (C13.2 DD2.6 R14.1 R17.1), ORD_CONNECTORS (X5.3)
A_VOL_3: ORD_FV1_1 (C13.1 DD2.7 R11.1), ORD_CONNECTORS (X5.4)
B_3V3: ORD_FV1_2 (5 pins), ORD_POWER (C7.1 DA2.1)
B_4V5: ORD_FV1_2 (DD7.10 DD7.12 R32.1 R38.1), ORD_POWER (C11.1 R7.1 R8.2), ORD_CONNECTORS (X6.2)
B_CTRL0_2: ORD_FV1_2 (DD8.20), ORD_CONNECTORS (X8.2)
B_CTRL1_2: ORD_FV1_2 (DD8.21), ORD_CONNECTORS (X8.5)
B_CTRL2_2: ORD_FV1_2 (DD8.22), ORD_CONNECTORS (X8.7)
B_MIX_1: ORD_FV1_2 (R33.1 R34.2), ORD_CONNECTORS (X6.3)
B_MIX_3: ORD_FV1_2 (R30.1 R31.2), ORD_CONNECTORS (X6.1)
B_SCL: ORD_FV1_2 (DD8.14 DD9.6), ORD_CONNECTORS (S3.6)
B_SDA: ORD_FV1_2 (DD8.15 DD9.5), ORD_CONNECTORS (S3.3), ORD_CH341A (R43.1)
B_VOL_1: ORD_FV1_2 (C26.2 DD7.9 R31.1 R34.1), ORD_CONNECTORS (X6.4)
B_VOL_3: ORD_FV1_2 (C26.1 DD7.8 R28.1), ORD_CONNECTORS (X6.5)
GND: ORD_FV1_1 (24 pins), ORD_FV1_2 (23 pins), ORD_POWER (21 pins), ORD_CONNECTORS (7 pins), ORD_CH341A (6 pins)
SCL: ORD_CONNECTORS (S3.5), ORD_CH341A (DD1.24)
SDA: ORD_CONNECTORS (S3.2), ORD_CH341A (DD1.23)
USB_N: ORD_CONNECTORS (X9.2), ORD_CH341A (DD1.11)
USB_P: ORD_CONNECTORS (X9.3), ORD_CH341A (DD1.10)